# EasyEDA Pro project TF_MUX_v0.8.0-rc.epro, schematic Schematic1_2
Board Name: nmux_5a; Create Date: 2025-04-27; Page Name: P1; Project Name: sd_mux; Schematic Name: Schematic1_2; Update Date: 2025-05-20; Company: 嘉立创EDA; Page Size: A4; Version: V1.0
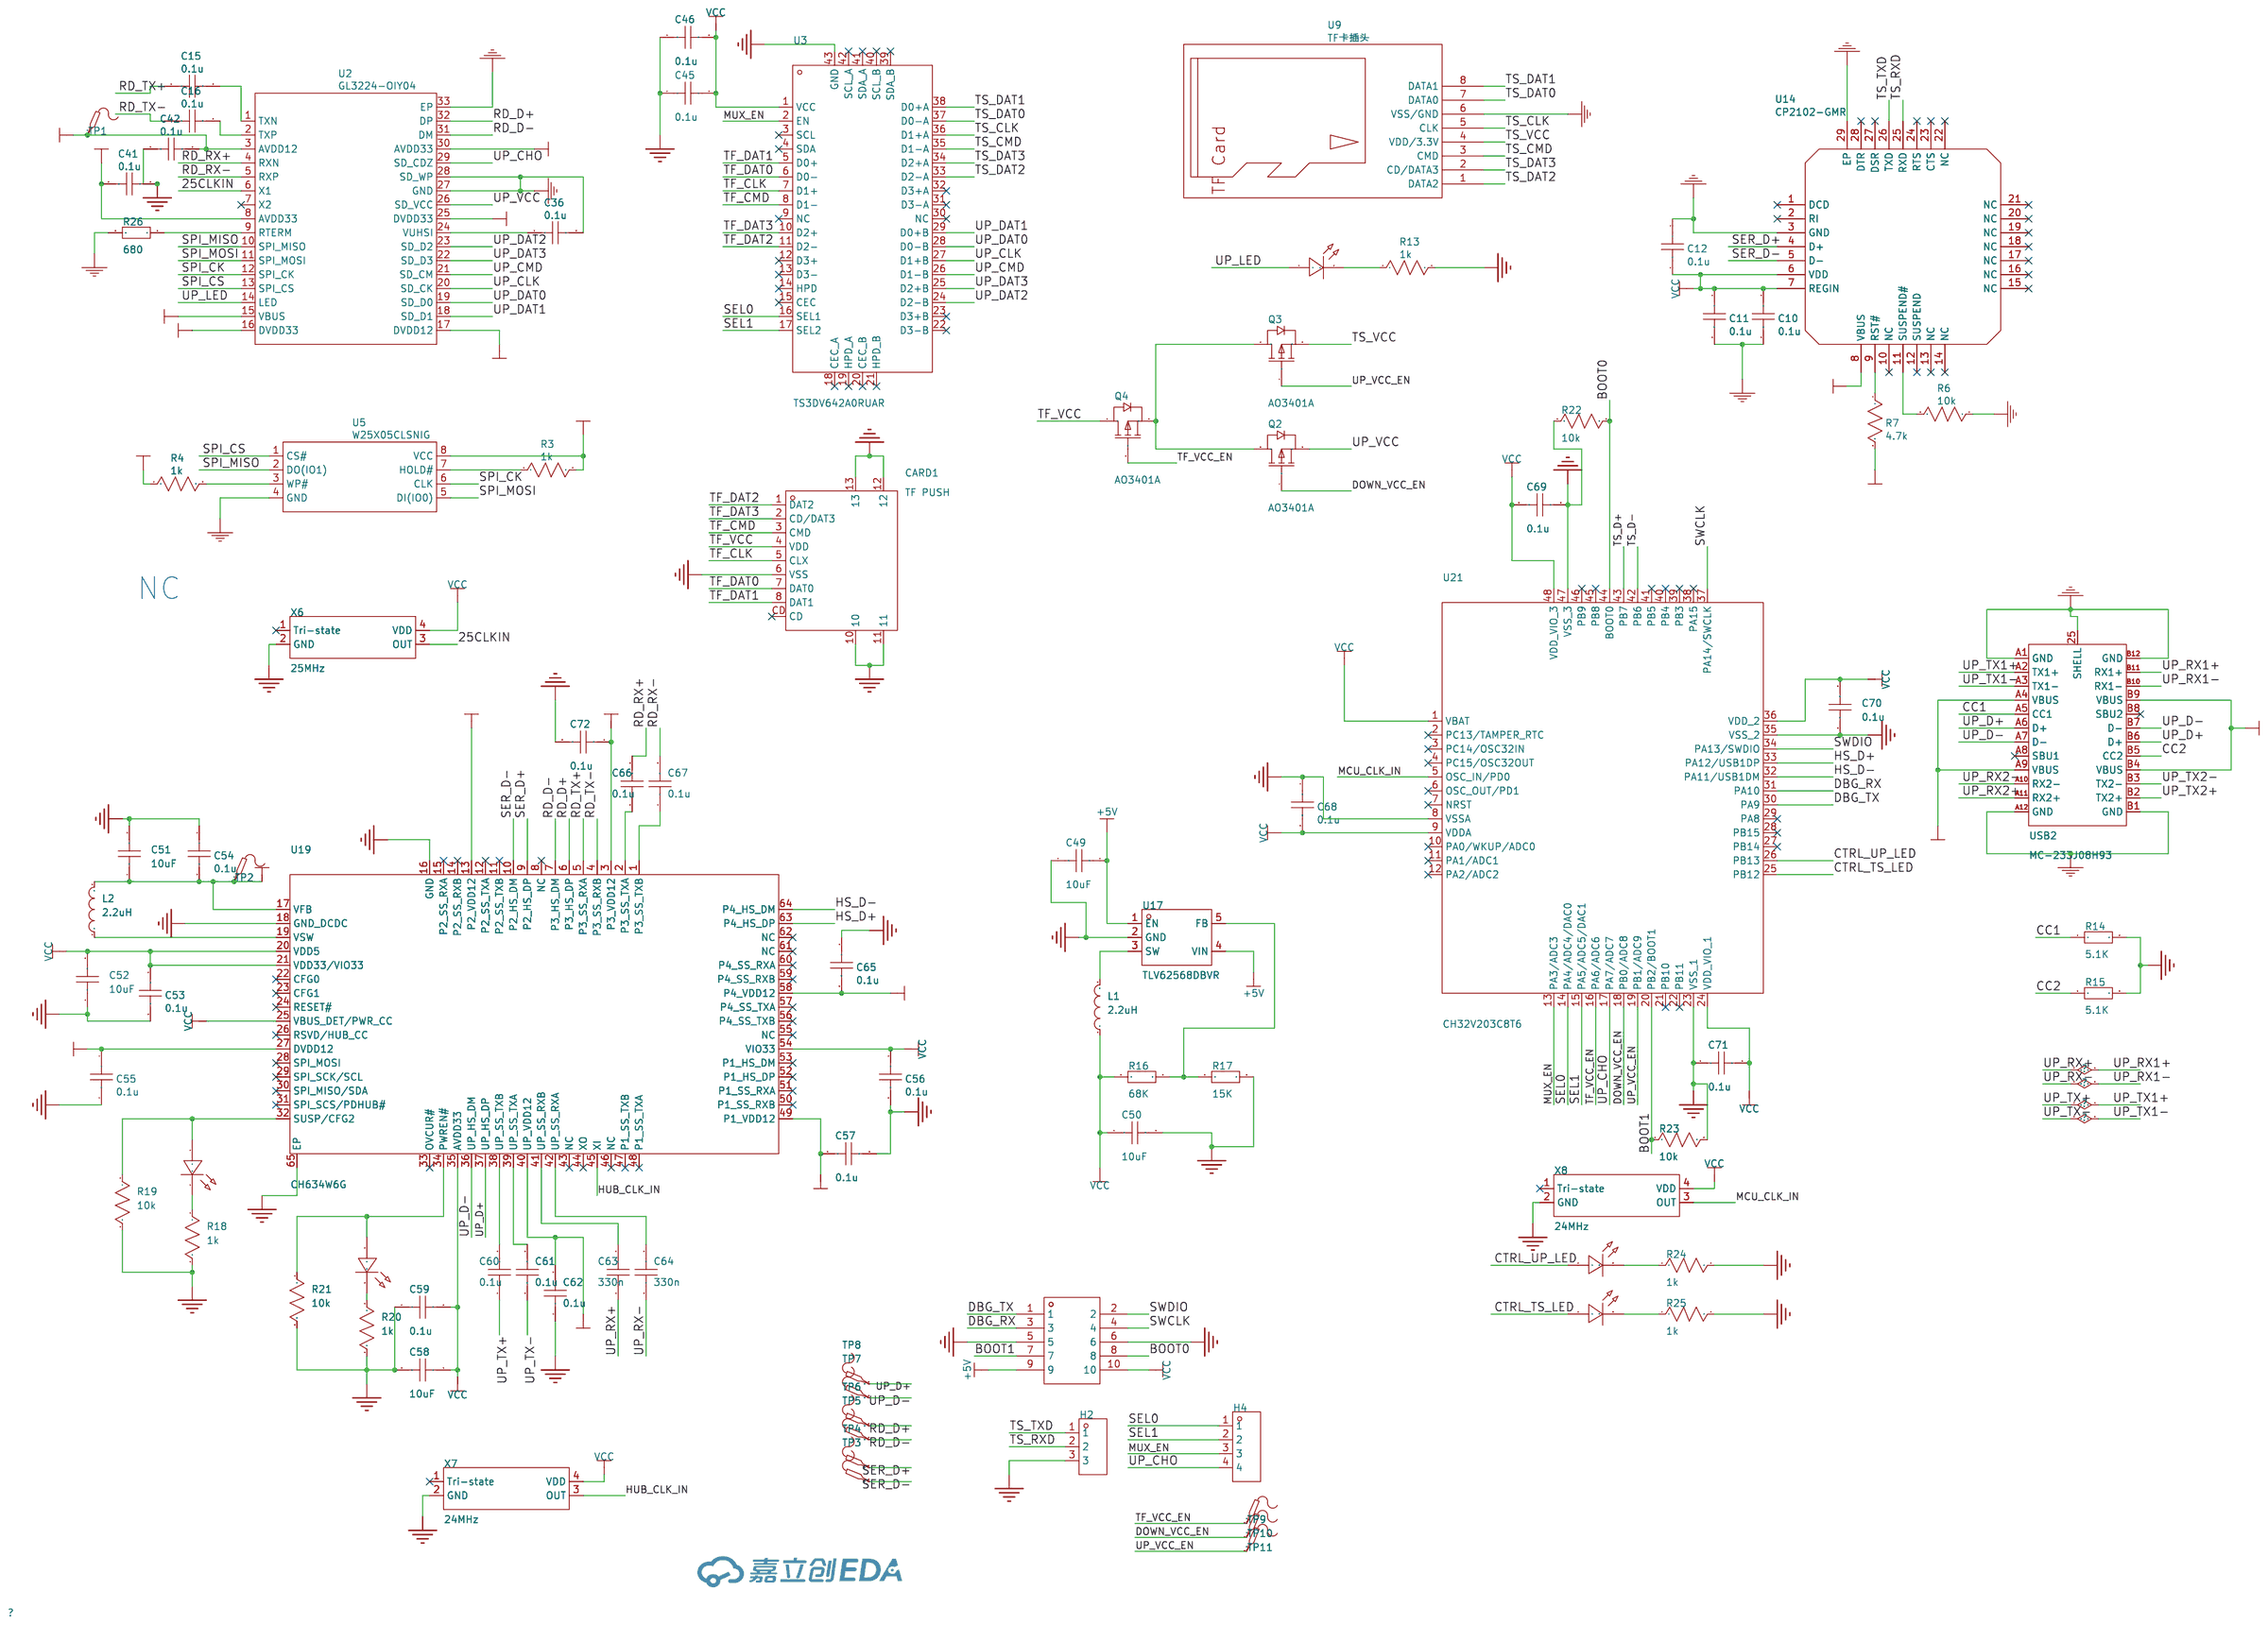
[diagram p0: schematic sheet]

## Parts
C10  0.1u  [C0603]
C11  0.1u  [C0603]
C12  0.1u  [C0603]
C15  0.1u  [C0603]
C16  0.1u  [C0603]
C36  0.1u  [C0603]
C41  0.1u  [C0603]
C42  0.1u  [C0603]
C45  0.1u  [C0603]
C46  0.1u  [C0603]
C49  10uF  [C0603]
C50  10uF  [C0603]
C51  10uF  [C0603]
C52  10uF  [C0603]
C53  0.1u  [C0603]
C54  0.1u  [C0603]
C55  0.1u  [C0603]
C56  0.1u  [C0603]
C57  0.1u  [C0603]
C58  10uF  [C0603]
C59  0.1u  [C0603]
C60  0.1u  [C0603]
C61  0.1u  [C0603]
C62  0.1u  [C0603]
C63  330n  [C0603]
C64  330n  [C0603]
C65  0.1u  [C0603]
C66  0.1u  [C0603]
C67  0.1u  [C0603]
C68  0.1u  [C0603]
C69  0.1u  [C0603]
C70  0.1u  [C0603]
C71  0.1u  [C0603]
C72  0.1u  [C0603]
CARD1  TF PUSH  [TF-SMD_TF-PUSH]
H2  -  [HDR-TH_3P-P2.54-V-M]  (no BOM)
H3  -  [HDR-TH_10P-P2.54-V-M-R2-C5-S2.54]  (no BOM)
H4  -  [HDR-TH_4P-P2.54-V-M]  (no BOM)
L1  2.2uH  [IND-SMD_L2.5-W2.0_MHCHL2520]
L2  2.2uH  [IND-SMD_L2.5-W2.0_MHCHL2520]
LED5  LTST-C191KSKT  [LED0603-RD-YELLOW]
LED6  LTST-C191KSKT  [LED0603-RD-YELLOW]
LED7  LTST-C191KSKT  [LED0603-RD-YELLOW]
LED8  LTST-C191KSKT  [LED0603-RD-YELLOW]
LED9  LTST-C191KSKT  [LED0603-RD-YELLOW]
Q2  AO3401A  [SOT-23_L2.9-W1.3-P1.90-LS2.4-BR]
Q3  AO3401A  [SOT-23_L2.9-W1.3-P1.90-LS2.4-BR]
Q4  AO3401A  [SOT-23_L2.9-W1.3-P1.90-LS2.4-BR]
R3  1k  [R0603]  (no BOM)
R4  1k  [R0603]  (no BOM)
R6  10k  [R0603]
R7  4.7k  [R0603]
R13  1k  [R0603]
R14  5.1K  [R0603]
R15  5.1K  [R0603]
R16  68K  [R0603]
R17  15K  [R0603]
R18  1k  [R0603]
R19  10k  [R0603]
R20  1k  [R0603]
R21  10k  [R0603]
R22  10k  [R0603]
R23  10k  [R0603]
R24  1k  [R0603]
R25  1k  [R0603]
R26  680  [R0603]
TP1  -  [Test-Point-0.5mm]
TP2  -  [Test-Point-0.5mm]
TP3  -  [Test-Point-0.5mm]
TP4  -  [Test-Point-0.5mm]
TP5  -  [Test-Point-0.5mm]
TP6  -  [Test-Point-0.5mm]
TP7  -  [Test-Point-0.5mm]
TP8  -  [Test-Point-0.5mm]
TP9  -  [Test-Point-0.5mm]
TP10  -  [Test-Point-0.5mm]
TP11  -  [Test-Point-0.5mm]
U2  GL3224-OIY04  [HQFN-32_L5.0-W5.0-P0.50-BL-EP3.0]
U3  TS3DV642A0RUAR  [WFQFN-42_L9.0-W3.5-P0.50-BL-EP]
U5  W25X05CLSNIG  [SOIC-8_L4.9-W3.9-P1.27-LS6.0-BL]  (no BOM)
U9  TF卡插头  [TF卡封装]  (no BOM)
U14  CP2102-GMR  [WQFN-28_L5.0-W5.0-P0.50-BL-EP3.2]
U17  TLV62568DBVR  [SOT-23-5_L3.0-W1.7-P0.95-LS2.8-BR]
U19  CH634W6G  [QFN-64_L8.0-W8.0-P0.40-TL-EP6.2]
U21  CH32V203C8T6  [LQFP-48_L7.0-W7.0-P0.50-LS9.0-BL]
USB2  MC-233J08H93  [USB-C-SMD_TYPE-C-31-M-20]
X6  25MHz  [OSC-SMD_4P-L2.5-W2.0-BL-1]  (no BOM)
X7  24MHz  [OSC-SMD_4P-L2.5-W2.0-BL]
X8  24MHz  [OSC-SMD_4P-L2.5-W2.0-BL]

## Library data of the parts
C10-C12 C15 C16 C36 C41 C42 C45 C46 C53-C57 C59-C72 = 0.1u
C49-C52 C58 = CAP_0603: Supplier Footprint: 0603
CARD1 = TF PUSH: 卡连接方式:自弹式;卡类型:MicroSD卡(TF卡);连接器类型:卡座;本体最大高度:2mm;工作温度范围:-20℃~+90℃;; LCSC Part Name: 自弹式 MicroSD卡(TF卡) 卡座; Supplier Part: C393941; Manufacturer: SHOU HAN(首韩); Supplier Footprint: SMD; JLCPCB Part Class: 扩展库; Datasheet: https://atta.szlcsc.com/upload/public/pdf/source/20191011/C393941_0DDD896EE907FEB750D8B7B8982E2A67.pdf; Supplier: LCSC; Card Connection Mode: 自弹式; Card Type: MicroSD卡(TF卡); Connector Type: 卡座; Additional Card Detection Pins: 无; Maximum Body Height: 2mm; Operating Temperature Range: -20℃~+90℃
H2 = HDR-M_2.54_1x3P: Supplier Part: C2937625; Supplier Footprint: 插件
H3 = HDR-M_2.54_2x5: Supplier Part: C124387; Supplier Footprint: 插件,P=2.54mm
H4 = HDR-M_2.54_1x4P: Supplier Part: C492403; Supplier Footprint: 插件
L1 L2 = FTC252012S2R2MBCA: 电感值:2.2uH;精度:±20%;额定电流:3A;饱和电流(Isat):3.8A;类型:一体成型电感;; LCSC Part Name: 2.2uH ±20% 3.8A; Supplier Part: C5832372; Manufacturer: cjiang(长江微电); Supplier Footprint: 1008; JLCPCB Part Class: 扩展库; Datasheet: https://atta.szlcsc.com/upload/public/pdf/source/20230602/8FFEDA9C0247A92A0D4B67554BFE4091.pdf; Supplier: LCSC; Tolerance: ±20%; Rated Current: 3A; Saturation Current (Isat): 3.8A; DC Resistance (DCR): 55mΩ; Type: 一体成型电感
LED5-LED9 = LTST-C191KSKT: 发光颜色:黄色;正向电压(VF):2.1V;功率:75mW;正向电流:20mA;主波长:584.5nm~597nm;二极管配置:-;透镜颜色:无色透明透镜;色温:-;发光强度:104mcd;发光角度:130°;载带方式:-;工作温度:-55℃~+85℃;; LCSC Part Name: 黄灯; Supplier Part: C125100; Manufacturer: LITEON(光宝); Supplier Footprint: 0603; JLCPCB Part Class: Extended Part; Datasheet: https://atta.szlcsc.com/upload/public/pdf/source/20180129/C125100_15171877314981315871.pdf; Supplier: LCSC; Emitted Color: 黄色; Forward Voltage (VF): 2.1V; Power Dissipation: 75mW; Forward Current: 20mA; Dominant Wavelength: 584.5nm~597nm; Peak Wavelength: 588nm; Lens Color: 无色透明透镜; Luminous Intensity: 104mcd; Viewing Angle: 130°; Operating Temperature: -55℃~+85℃
Q2-Q4 = AO3401A_C15127: 类型:1个P沟道;漏源电压(Vdss):30V;连续漏极电流(Id):4A;导通电阻(RDS(on)@Vgs,Id):44mΩ@10V,4.3A;功率(Pd):1.4W;阈值电压(Vgs(th)@Id):1.3V@250uA;; LCSC Part Name: 1个P沟道 耐压:30V 电流:4A; Supplier Part: C15127; Manufacturer: AOS; Supplier Footprint: SOT-23; JLCPCB Part Class: 基础库; Datasheet: https://atta.szlcsc.com/upload/public/pdf/source/20160507/1462613609053.pdf; Supplier: LCSC; Type: 1个P沟道; Drain Source Voltage (Vdss): 30V; Continuous Drain Current (Id): 4A; Drain Source On Resistance (RDS(on)@Vgs,Id): 44mΩ@10V,4.3A; Power Dissipation (Pd): 1.4W; Gate Threshold Voltage (Vgs(th)@Id): 1.3V@250uA; Total Gate Charge (Qg@Vgs): 12.2nC@4.5V; Input Capacitance (Ciss@Vds): 1.2nF@15V; Operating Temperature: -55℃~+150℃@(Tj)
R3 R4 R13 R18-R25 = 1k
R6 = 10k
R7 = 4.7k
R14-R17 R26 = Res_0603: Supplier Footprint: 0603
TP1-TP8 = Test-Point: Test Point 测试点; Check: false
TP9-TP11 = Test-Point: Test Point 测试点
U2 = GL3224-OIY04: Supplier: LCSC; Supplier Part: C157357; Manufacturer: GENESYS(创惟); JLCPCB Part Class: Extended Part
U3 = TS3DV642A0RUAR: 开关电路:单刀双掷(SPDT);通道数:12;导通电阻(Ron@VCC):9.5Ω;; LCSC Part Name: 具有1.8V兼容控制和断电模式的12通道1:2多路复用器/多路解复用器; Supplier Part: C157482; Manufacturer: TI(德州仪器); Supplier Footprint: WFQFN-42-EP(3.5x9); JLCPCB Part Class: 扩展库; Datasheet: https://www.ti.com/cn/lit/gpn/ts3dv642; Supplier: LCSC; Switch Circuit: 单刀双掷(SPDT); Number of Channels: 12; Supply Voltage: 2.6V~4.5V; Turn-on time: 100ns; On-State Resistance (Max): 9.5Ω; Operating Temperature: -40℃~+85℃
U5 = W25X05CLSNIG: Supplier: LCSC; Supplier Part: C2641187; Manufacturer: WINBOND(华邦); JLCPCB Part Class: Extended Part
U9 = TF卡插头: Supplier: HeZo
U14 = CP2102-GMR: Supplier: LCSC; Manufacturer: SKYWORKS/SILICON LABS(芯科); Supplier Part: C6568; JLCPCB Part Class: Extended Part
U17 = TLV62568DBVR: 功能类型:降压型;输出类型:可调;工作电压:2.5V~5.5V;输出电压:600mV~5.5V;输出电流:1A;; LCSC Part Name: 1A高效同步降压转换器; Supplier Part: C163219; Manufacturer: TI(德州仪器); Supplier Footprint: SOT-23-5; JLCPCB Part Class: 扩展库; Datasheet: https://www.ti.com/cn/lit/gpn/tlv62568; Supplier: LCSC; Function: 降压型; Output Type: 可调; Input Voltage: 2.5V~5.5V; Output Voltage: 600mV~5.5V; Output Current: 1A; Switching Frequency: 1.5MHz; Operating Temperature: -40℃~+125℃@(TJ); Synchronous Rectification: 是; Number of Outputs: 1; Topology: 降压式; Switch tube (built-in/external): 内置
U19 = CH634W6G: 工业级4端口USB3.0超高速HUB芯片，符合USB3.2 Gen1协议规范，兼容USB2.0。内置PD控制器，支持Type-C快充。支持整体过流检测和电源控制，内置EEPROM信息配置，支持PDHUB 100W、Type-C 15W和BC快充。; Supplier Part: C45986779; Manufacturer: WCH(南京沁恒); Supplier Footprint: QFN-64-EP(8x8); JLCPCB Part Class: 扩展库; Datasheet: https://atta.szlcsc.com/upload/public/pdf/source/20250227/7AD0E05704B18E033392A25CBB5388D5.pdf; Supplier: LCSC
U21 = CH32V203C8T6: CPU内核:RISC-V;程序存储容量:64KB;RAM总容量:20KB;GPIO端口数量:-;工作电压范围:-;CPU最大主频:144MHz;程序存储器类型:FLASH;; Supplier Part: C3001172; Manufacturer: WCH(南京沁恒); Supplier Footprint: LQFP-48(7x7); JLCPCB Part Class: 扩展库; Datasheet: https://atta.szlcsc.com/upload/public/pdf/source/20220425/D3E728E801B9982E2758AC225E3A30F9.pdf; Supplier: LCSC; CPU Core: RISC-V; Program Storage Size: 64KB; RAM Size: 20KB; CPU Maximum Speed: 144MHz; Program Memory Type: FLASH
USB2 = MC-233J08H93: 连接器类型:Type-C;标准:USB 3.1;公母:母;端口数量:1;触点数量:24P;安装方式:夹板;额定电流 - 电源:5A;触头材质:-;触头镀层:-;工作温度范围:-25℃~+85℃;焊接温度(最大值):-;; LCSC Part Name: Type-C 母 夹板; Supplier Part: C3039310; Manufacturer: HANBO(汉博); Supplier Footprint: SMD; JLCPCB Part Class: 扩展库; Datasheet: https://atta.szlcsc.com/upload/public/pdf/source/20221111/B4F254868FFB29F45126513D1A8046E4.pdf; Supplier: LCSC; Connector Type: Type-C; Standard: USB 3.1; Gender: 母; Number of Ports: 1; Number of Contacts: 24P; Mounting Style: 夹板; Current Rating - Power (Max): 5A; Operating Temperature Range: -25℃~+85℃
X6 = OT252025MJBA4SL: 频率:25MHz;常温频差:±10ppm;输出模式:CMOS;工作电压:1.8V~3.3V;频率稳定度:±20ppm;; LCSC Part Name: 25MHz ±10ppm 1.8V~3.3V YSO110TR; Supplier Part: C717683; Manufacturer: YXC(扬兴晶振); Supplier Footprint: SMD2520-4P; JLCPCB Part Class: 扩展库; Datasheet: https://atta.szlcsc.com/upload/public/pdf/source/20240731/596E5F7673E50DA744B7F79F139FB8DF.pdf; Supplier: LCSC; Normal temperature Frequency Tolerance: ±10ppm; Output Type: CMOS; Voltage - Supply: 1.8V~3.3V; Frequency Stability: ±20ppm; Operating Temperature: -40℃~+85℃
X7 X8 = OT252024MJBA4SL: 频率:24MHz;常温频差:±10ppm;输出模式:CMOS;工作电压:1.8V~3.3V;工作电流:4mA;频率稳定度:±20ppm;; LCSC Part Name: 24MHz ±10ppm 1.8V~3.3V YSO110TR; Supplier Part: C669072; Manufacturer: YXC(扬兴晶振); Supplier Footprint: SMD2520-4P; JLCPCB Part Class: 扩展库; Datasheet: https://atta.szlcsc.com/upload/public/pdf/source/20240731/596E5F7673E50DA744B7F79F139FB8DF.pdf; Supplier: LCSC; Normal temperature Frequency Tolerance: ±10ppm; Output Type: CMOS; Voltage - Supply: 1.8V~3.3V; Current - Supply: 4mA; Frequency Stability: ±20ppm; Operating Temperature: -40℃~+85℃

## Nets
+5V: C49.2 H3.9 U14.8(VBUS) U17.1(EN) U17.4(VIN) USB2.A4(VBUS) USB2.A9(VBUS) USB2.B4(VBUS) USB2.B9(VBUS)
GND: C10.2 C11.2 C12.1 C36.2 C41.2 C42.1 C45.1 C46.1 C49.1 C50.2 C51.2 C52.1 C53.2 C54.1 C55.2 C56.2 C57.2 C58.2 C59.1 C62.1 C65.1 C68.1 C69.2 C70.1 C71.1 C72.2 CARD1.6(VSS) CARD1.10 CARD1.11 CARD1.12 CARD1.13 H2.3 H3.5 H3.6 R6.1 R13.2 R14.2 R15.2 R17.2 R18.2 R19.2 R20.2 R21.2 R22.1 R23.2 R24.2 R25.2 R26.1 U2.27(GND) U2.28(SD_WP) U2.33(EP) U3.43(GND) U5.4(GND) U9.6(VSS/GND) U14.3(GND) U14.29(EP) U17.2(GND) U19.16(GND) U19.18(GND_DCDC) U19.65(EP) U21.8(VSSA) U21.23(VSS_1) U21.35(VSS_2) U21.47(VSS_3) USB2.25(SHELL) USB2.A1(GND) USB2.A12(GND) USB2.B1(GND) USB2.B12(GND) X6.2(GND) X7.2(GND) X8.2(GND)
VCC: C10.1 C11.1 C12.2 C41.1 C45.2 C46.2 C50.1 C52.2 C53.1 C56.1 C58.1 C59.2 C68.2 C69.1 C70.2 C71.2 H3.10 L1.1 R3.2 R4.1 R7.2 R16.1 U2.8(AVDD33) U2.15(VBUS) U2.16(DVDD33) U2.25(DVDD33) U2.30(AVDD33) U3.1(VCC) U5.8(VCC) U14.6(VDD) U14.7(REGIN) U19.20(VDD5) U19.21(VDD33/VIO33) U19.25(VBUS_DET/PWR_CC) U19.35(AVDD33) U19.54(VIO33) U21.1(VBAT) U21.9(VDDA) U21.24(VDD_VIO_1) U21.36(VDD_2) U21.48(VDD_VIO_3) X6.4(VDD) X7.4(VDD) X8.4(VDD)
25CLKIN: U2.6(X1) X6.3(OUT)
BOOT0: H3.8 R22.2 U21.44(BOOT0)
BOOT1: H3.7 R23.1 U21.20(PB2/BOOT1)
CC1: R14.1 USB2.A5(CC1)
CC2: R15.1 USB2.B5(CC2)
CTRL_TS_LED: LED9.1 U21.25(PB12)
CTRL_UP_LED: LED8.1 U21.26(PB13)
DBG_RX: H3.3 U21.31(PA10)
DBG_TX: H3.1 U21.30(PA9)
DOWN_VCC_EN: Q2.1(G) TP10.1 U21.18(PB0/ADC8)
HS_D+: U19.63(P4_HS_DP) U21.33(PA12/USB1DP)
HS_D-: U19.64(P4_HS_DM) U21.32(PA11/USB1DM)
HUB_CLK_IN: U19.45(XI) X7.3(OUT)
MCU_CLK_IN: U21.5(OSC_IN/PD0) X8.3(OUT)
MUX_EN: H4.3 U3.2(EN) U21.13(PA3/ADC3)
RD_1V2: C42.2 TP1.1 U2.3(AVDD12) U2.17(DVDD12)
RD_D+: TP6.1 U2.32(DP) U19.6(P3_HS_DP)
RD_D-: TP5.1 U2.31(DM) U19.7(P3_HS_DM)
RD_RX+: C66.2 U2.4(RXN)
RD_RX-: C67.2 U2.5(RXP)
RD_TX+: C15.1 U19.5(P3_SS_RXA)
RD_TX-: C16.1 U19.4(P3_SS_RXB)
SEL0: H4.1 U3.16(SEL1) U21.14(PA4/ADC4/DAC0)
SEL1: H4.2 U3.17(SEL2) U21.15(PA5/ADC5/DAC1)
SER_D+: TP4.1 U14.4(D+) U19.9(P2_HS_DP)
SER_D-: TP3.1 U14.5(D-) U19.10(P2_HS_DM)
SPI_CK: U2.12(SPI_CK) U5.6(CLK)
SPI_CS: U2.13(SPI_CS) U5.1(CS#)
SPI_MISO: U2.10(SPI_MISO) U5.2(DO(IO1))
SPI_MOSI: U2.11(SPI_MOSI) U5.5(DI(IO0))
SWCLK: H3.4 U21.37(PA14/SWCLK)
SWDIO: H3.2 U21.34(PA13/SWDIO)
TF_1V2: C51.1 C54.2 C55.1 C57.1 C62.2 C65.2 C72.1 L2.2 TP2.1 U19.3(P3_VDD12) U19.13(P2_VDD12) U19.17(VFB) U19.27(DVDD12) U19.40(UP_VDD12) U19.49(P1_VDD12) U19.58(P4_VDD12)
TF_CLK: CARD1.5(CLX) U3.7(D1+)
TF_CMD: CARD1.3(CMD) U3.8(D1-)
TF_DAT0: CARD1.7(DAT0) U3.6(D0-)
TF_DAT1: CARD1.8(DAT1) U3.5(D0+)
TF_DAT2: CARD1.1(DAT2) U3.11(D2-)
TF_DAT3: CARD1.2(CD/DAT3) U3.10(D2+)
TF_VCC: CARD1.4(VDD) Q4.3(D)
TF_VCC_EN: Q4.1(G) TP9.1 U21.16(PA6/ADC6)
TS_CLK: U3.36(D1+A) U9.5(CLK)
TS_CMD: U3.35(D1-A) U9.3(CMD)
TS_D+: U21.43(PB7)
TS_D-: U21.42(PB6)
TS_DAT0: U3.37(D0-A) U9.7(DATA0)
TS_DAT1: U3.38(D0+A) U9.8(DATA1)
TS_DAT2: U3.33(D2-A) U9.1(DATA2)
TS_DAT3: U3.34(D2+A) U9.2(CD/DATA3)
TS_RXD: H2.2 U14.25(RXD)
TS_TXD: H2.1 U14.26(TXD)
TS_VCC: Q3.2(S) U9.4(VDD/3.3V)
UP_CHO: H4.4 U2.29(SD_CDZ) U21.17(PA7/ADC7)
UP_CLK: U2.20(SD_CK) U3.27(D1+B)
UP_CMD: U2.21(SD_CM) U3.26(D1-B)
UP_D+: TP8.1 U19.37(UP_HS_DP) USB2.A6(D+) USB2.B6(D+)
UP_D-: TP7.1 U19.36(UP_HS_DM) USB2.A7(D-) USB2.B7(D-)
UP_DAT0: U2.19(SD_D0) U3.28(D0-B)
UP_DAT1: U2.18(SD_D1) U3.29(D0+B)
UP_DAT2: U2.23(SD_D2) U3.24(D2-B)
UP_DAT3: U2.22(SD_D3) U3.25(D2+B)
UP_LED: LED5.1 U2.14(LED)
UP_RX2+: USB2.A11(RX2+)
UP_RX2-: USB2.A10(RX2-)
UP_RX+: C63.1 USB2.B11(RX1+)
UP_RX-: C64.1 USB2.B10(RX1-)
UP_TX2+: USB2.B2(TX2+)
UP_TX2-: USB2.B3(TX2-)
UP_TX+: C60.1 USB2.A2(TX1+)
UP_TX-: C61.1 USB2.A3(TX1-)
UP_VCC: Q2.2(S) U2.26(SD_VCC)
UP_VCC_EN: Q3.1(G) TP11.1 U21.19(PB1/ADC9)
$1N442: R26.2 U2.9(RTERM)
$1N465: C16.2 U2.2(TXP)
$1N466: C15.2 U2.1(TXN)
$1N469: C36.1 U2.24(VUHSI)
$1N1150: LED5.2 R13.1
$1N2251: R3.1 U5.7(HOLD#)
$1N2254: R4.2 U5.3(WP#)
$1N5720: R6.2 U14.11(SUSPEND#)
$1N5721: R7.1 U14.9(RST#)
$1N13369: L1.2 U17.3(SW)
$1N13628: R16.2 R17.1 U17.5(FB)
$1N14755: L2.1 U19.19(VSW)
$1N15481: LED6.1 R19.1 U19.32(SUSP/CFG2)
$1N15483: LED6.2 R18.1
$1N15725: LED7.1 R21.1 U19.34(PWREN#)
$1N15730: LED7.2 R20.1
$1N15963: C60.2 U19.38(UP_SS_TXB)
$1N15967: C61.2 U19.39(UP_SS_TXA)
$1N16097: C63.2 U19.41(UP_SS_RXB)
$1N16103: C64.2 U19.42(UP_SS_RXA)
$1N16323: C66.1 U19.2(P3_SS_TXA)
$1N16329: C67.1 U19.1(P3_SS_TXB)
$1N18923: LED8.2 R24.1
$1N18990: LED9.2 R25.1
$1N27147: Q2.3(D) Q3.3(D) Q4.2(S)

Not connected (* = marked no-connect by the designer): CARD1 CD*; U2 7(X2)*; U3 3(SCL)* 4(SDA)* 9(NC)* 12(D3+)* 13(D3-)* 14(HPD)* 15(CEC)* 18(CEC_A)* 19(HPD_A)* 20(CEC_B)* 21(HPD_B)* 22(D3-B)* 23(D3+B)* 30(NC)* 31(D3-A)* 32(D3+A)* 39(SDA_B)* 40(SCL_B)* 41(SDA_A)* 42(SCL_A)*; U14 1(DCD)* 2(RI)* 10(NC)* 12(SUSPEND)* 13(NC)* 14(NC)* 15(NC)* 16(NC)* 17(NC)* 18(NC)* 19(NC)* 20(NC)* 21(NC)* 22(NC)* 23(CTS)* 24(RTS)* 27(DSR)* 28(DTR)*; U19 8(NC)* 11(P2_SS_TXB)* 12(P2_SS_TXA)* 14(P2_SS_RXB)* 15(P2_SS_RXA)* 22(CFG0)* 23(CFG1)* 24(RESET#)* 26(RSVD/HUB_CC)* 28(SPI_MOSI)* 29(SPI_SCK/SCL)* 30(SPI_MISO/SDA)* 31(SPI_SCS/PDHUB#)* 33(OVCUR#)* 43(NC)* 44(XO)* 46(NC)* 47(P1_SS_TXB)* 48(P1_SS_TXA)* 50(P1_SS_RXB)* 51(P1_SS_RXA)* 52(P1_HS_DP)* 53(P1_HS_DM)* 55(NC)* 56(P4_SS_TXB)* 57(P4_SS_TXA)* 59(P4_SS_RXB)* 60(P4_SS_RXA)* 61(NC)* 62(NC)*; U21 2(PC13/TAMPER_RTC)* 3(PC14/OSC32IN)* 4(PC15/OSC32OUT)* 6(OSC_OUT/PD1)* 7(NRST)* 10(PA0/WKUP/ADC0)* 11(PA1/ADC1)* 12(PA2/ADC2)* 21(PB10)* 22(PB11)* 27(PB14)* 28(PB15)* 29(PA8)* 38(PA15)* 39(PB3)* 40(PB4)* 41(PB5)* 45(PB8)* 46(PB9)*; USB2 A8(SBU1)* B8(SBU2)*; X6 1(Tri-state)*; X7 1(Tri-state)*; X8 1(Tri-state)*

## Notes on the sheet
- NC
